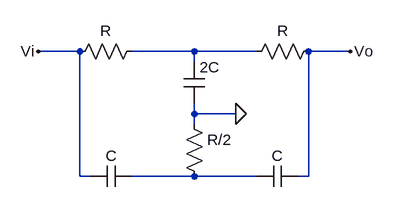
[diagram p0: schematic ej1_filtro_inicial.asc]
ej1_filtro_inicial.asc, the LTspice schematic file:
Version 4
SHEET 1 880 680
WIRE 32 64 -32 64
WIRE 208 64 112 64
WIRE 304 64 208 64
WIRE 448 64 384 64
WIRE 208 80 208 64
WIRE 208 160 208 144
WIRE 272 160 208 160
WIRE 208 176 208 160
WIRE 32 256 32 64
WIRE 48 256 32 256
WIRE 208 256 112 256
WIRE 304 256 208 256
WIRE 384 256 384 64
WIRE 384 256 368 256
FLAG 272 160 0
FLAG -32 64 Vi
FLAG 448 64 Vo
SYMBOL res 128 48 R90
WINDOW 0 0 56 VBottom 2
WINDOW 3 32 56 VTop 2
SYMATTR InstName R
SYMATTR Value ""
SYMBOL res 400 48 R90
WINDOW 0 0 56 VBottom 2
WINDOW 3 32 56 VTop 2
SYMATTR InstName R
SYMATTR Value ""
SYMBOL res 192 160 R0
SYMATTR InstName R/2
SYMATTR Value ""
SYMBOL cap 192 80 R0
SYMATTR InstName 2C
SYMATTR Value ""
SYMBOL cap 112 240 R90
WINDOW 0 0 32 VBottom 2
WINDOW 3 32 32 VTop 2
SYMATTR InstName C
SYMATTR Value ""
SYMBOL cap 368 240 R90
WINDOW 0 0 32 VBottom 2
WINDOW 3 32 32 VTop 2
SYMATTR InstName C
SYMATTR Value ""

The netlist it stands for:
* ej1_filtro_inicial.asc
R N001 Vi
R Vo N001
R/2 0 N002
C§2C N001 0
C N002 Vi
C Vo N002
.backanno
.end